# Altium schematic sheet Shift_Register.SchDoc: 8ch_RGB_Controller
size A4; ApprovedBy: Selyutin A.; CheckedBy: Selyutin A.; Author: Selyutin A.; CompanyName: Circuit Craft Lab; DrawnBy: Selyutin A.; Engineer: Selyutin A.; Organization: Circuit Craft Lab; Address1: Russia; Address2: Nevinnomissk; DocumentNumber: 6; Revision: 1.0; SheetNumber: 6; SheetTotal: 7
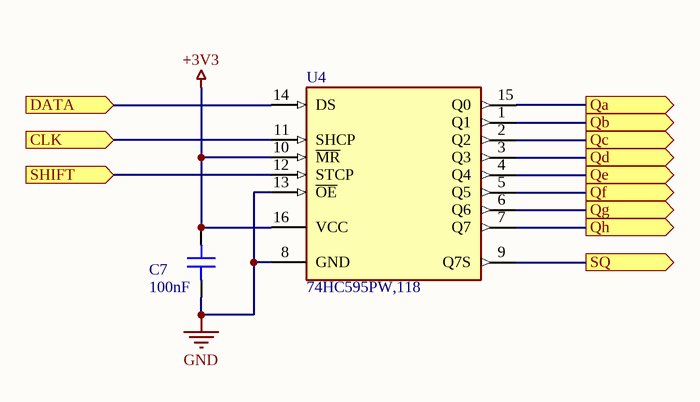
[diagram p0: Shift_Register.SchDoc]

## Parts
C7  Capacitance: 100nF  [CAPC1608X08N]  (hidden comment: CL10B104KO8NNNC)
U4  74HC595PW,118  [SOP65P640X110-16N]

## Ports
CLK (in), DATA (in), Qa (out), Qb (out), Qc (out), Qd (out), Qe (out), Qf (out), Qg (out), Qh (out), SHIFT (in), SQ (out)

## Nets
+3V3: C7.2 U4.10(~{MR}) U4.16(VCC)
GND: C7.1 U4.8(GND) U4.13(~{OE})
CLK: U4.11(SHCP) ; port CLK
DATA: U4.14(DS) ; port DATA
Qa: U4.15(Q0) ; port Qa
Qb: U4.1(Q1) ; port Qb
Qc: U4.2(Q2) ; port Qc
Qd: U4.3(Q3) ; port Qd
Qe: U4.4(Q4) ; port Qe
Qf: U4.5(Q5) ; port Qf
Qg: U4.6(Q6) ; port Qg
Qh: U4.7(Q7) ; port Qh
SHIFT: U4.12(STCP) ; port SHIFT
SQ: U4.9(Q7S) ; port SQ

## Notes on the sheet
- Title:
- Author:
- Approved:
- Size:
- Date:
- Git Hash:
- A4
- Prj:
- SW Version:
- Variant:
- Edited:
- CONFIDENTIAL
- File:

## Library data of the parts
C7 = CMP-178-0002-5: SAMSUNG ELECTRO-MECHANICS - CL10B104KO8NNNC - SMD Multilayer Ceramic Capacitor, 0.1 µF, 16 V, 0603 [1608 Metric], ± 10%, X7R, CL Series; Voltage Rating: 16V; Contact Plating: Tin; Thickness: 889µm; Voltage Rating (AC): 16V; Radiation Hardening: No; Voltage: 16V; Manufacturer: SAMSUNG ELECTRO-MECHANICS; Case Code (Imperial): 0603; Height: 800µm; Depth: 800µm; Manufacturer Part Number: CL10B104KO8NNNC; Voltage Rating (DC): 16V; Width: 787.4µm; Mount: Surface Mount; Packaging: Tape and Reel; Length: 1.6mm; Case Code (Metric): 1608; Max Operating Temperature: 125°C; Package Quantity: 1; Lead Free: Lead Free; Number of Pins: 2; Dielectric: X7R; Case/Package: 0603; Dielectric Material: X7R; Min Operating Temperature: -55°C; Tolerance: 10%
U4 = CMP-139-0001-2: 74HC Series 6 V 3-St 8-Bit Serial-In Serial/Parallel-Out Shift Register-TSSOP-16; Manufacturer: NXP; Number of Circuits: 1; Max Supply Voltage: 6V; Direction: Unidirectional; Turn-On Delay Time: 265ns; Min Supply Voltage: 2V; Quiescent Current: 160µA; Propagation Delay: 30ns; Frequency: 100MHz; Number of Output Lines: 3; Number of Bits per Element: 8; Operating Supply Voltage: 5V; Min Operating Temperature: -40°C; Radiation Hardening: No; Manufacturer Part Number: 74HC595PW,118; REACH SVHC: No SVHC; Package Quantity: 2500; Weight: 113.3981g; Max Operating Temperature: 125°C; Mount: Surface Mount; Number of Pins: 16; Number of Inputs: 1; Height: 6.35mm; Case/Package: TSSOP; Width: 6.35mm; Logic Function: Shift Register; Contact Plating: Gold; Lead Free: Lead Free; Number of Elements: 1; Number of Outputs: 8; Length: 6.35mm; Number of Input Lines: 1; Packaging: Tape and Reel; Number of Bits: 8